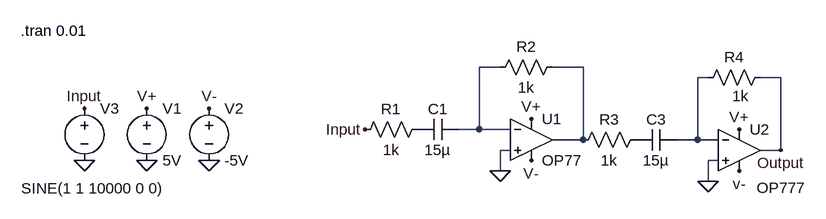
[diagram p0: schematic Signal level shifting circuit.asc]
Signal level shifting circuit.asc, the LTspice schematic file:
Version 4
SHEET 1 1032 680
WIRE 544 64 512 64
WIRE 672 64 624 64
WIRE 864 80 848 80
WIRE 976 80 944 80
WIRE 512 160 512 64
WIRE 512 160 480 160
WIRE 560 160 512 160
WIRE 672 176 672 64
WIRE 672 176 624 176
WIRE 848 176 848 80
WIRE 848 176 816 176
WIRE 880 176 848 176
WIRE 560 192 544 192
WIRE 976 192 976 80
WIRE 976 192 944 192
WIRE 880 208 864 208
WIRE 544 224 544 192
WIRE 864 240 864 208
FLAG 0 208 0
FLAG 96 208 0
FLAG 0 128 V+
FLAG 592 144 V+
FLAG 96 128 V-
FLAG 592 208 V-
FLAG 544 224 0
FLAG 336 160 Input
FLAG -96 128 Input
FLAG -96 208 0
FLAG 976 192 Output
FLAG 864 240 0
FLAG 912 160 V+
FLAG 912 224 v-
SYMBOL res 432 144 R90
WINDOW 0 0 56 VBottom 2
WINDOW 3 32 56 VTop 2
SYMATTR InstName R1
SYMATTR Value 1k
SYMBOL cap 480 144 R90
WINDOW 0 0 32 VBottom 2
WINDOW 3 32 32 VTop 2
SYMATTR InstName C1
SYMATTR Value 15µ
SYMBOL res 640 48 R90
WINDOW 0 0 56 VBottom 2
WINDOW 3 32 56 VTop 2
SYMATTR InstName R2
SYMATTR Value 1k
SYMBOL OpAmps\\OP77 592 112 R0
SYMATTR InstName U1
SYMBOL voltage 0 112 R0
WINDOW 123 0 0 Left 0
WINDOW 39 0 0 Left 0
SYMATTR InstName V1
SYMATTR Value 5V
SYMBOL voltage 96 112 R0
WINDOW 123 0 0 Left 0
WINDOW 39 0 0 Left 0
SYMATTR InstName V2
SYMATTR Value -5V
SYMBOL voltage -96 112 R0
WINDOW 3 -97 139 Left 2
WINDOW 123 0 0 Left 0
WINDOW 39 0 0 Left 0
SYMATTR InstName V3
SYMATTR Value SINE(1 1 10000 0 0)
SYMBOL res 768 160 R90
WINDOW 0 0 56 VBottom 2
WINDOW 3 32 56 VTop 2
SYMATTR InstName R3
SYMATTR Value 1k
SYMBOL cap 816 160 R90
WINDOW 0 0 32 VBottom 2
WINDOW 3 32 32 VTop 2
SYMATTR InstName C3
SYMATTR Value 15µ
SYMBOL OpAmps\\OP777 912 128 R0
WINDOW 3 27 122 Left 2
SYMATTR InstName U2
SYMBOL res 960 64 R90
WINDOW 0 0 56 VBottom 2
WINDOW 3 29 46 VTop 2
SYMATTR InstName R4
SYMATTR Value 1k
TEXT -194 8 Left 2 !.tran 0.01

The netlist it stands for:
* Signal level shifting circuit.asc
R1 P001 Input 1k
C1 N001 P001 15µ
R2 N002 N001 1k
XU1 0 N001 V+ V- N002 OP77  ; pins In+ In- V+ V- OUT
V1 V+ 0 5V
V2 V- 0 -5V
V3 Input 0 SINE(1 1 10000 0 0)
R3 P002 N002 1k
C3 N003 P002 15µ
XU2 0 N003 V+ V- Output OP777  ; pins In+ In- V+ V- OUT
R4 Output N003 1k
.tran 0.01
.lib ADI.lib
.backanno
.end